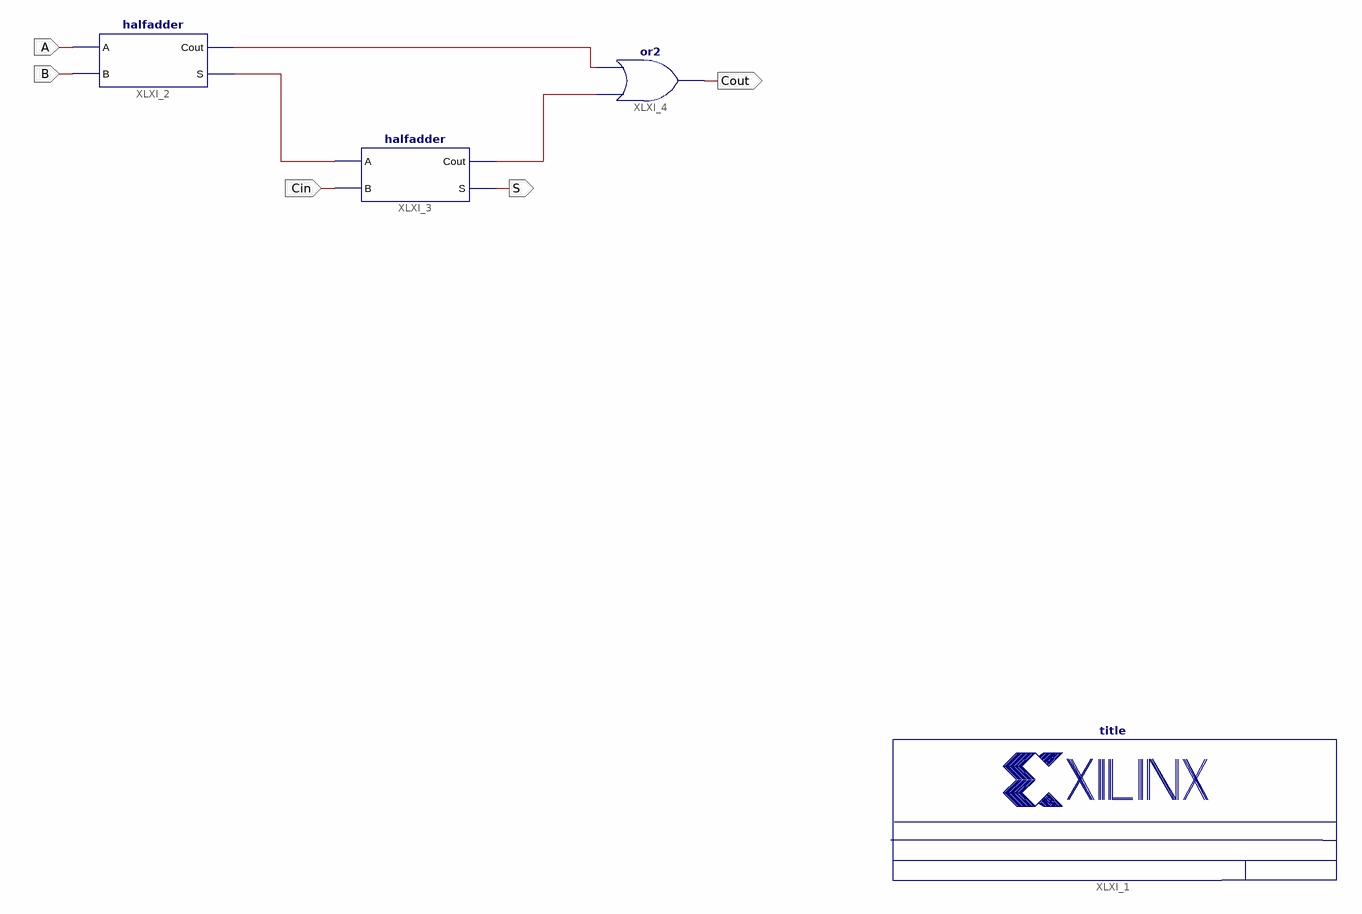
[diagram p0: schematic sheet 1]
// Xilinx ISE schematic fulladder.sch (spartan3e) as structural Verilog: 4 symbols, 5 ports
module fulladder (
  input  A,
  input  B,
  input  Cin,
  output Cout,
  output S
);

  wire XLXN_1, XLXN_3, XLXN_5;

  title XLXI_1 ();
  halfadder XLXI_2 (.A(A), .B(B), .Cout(XLXN_1), .S(XLXN_5));
  halfadder XLXI_3 (.A(XLXN_5), .B(Cin), .Cout(XLXN_3), .S(S));
  or XLXI_4 (Cout, XLXN_3, XLXN_1);
endmodule
